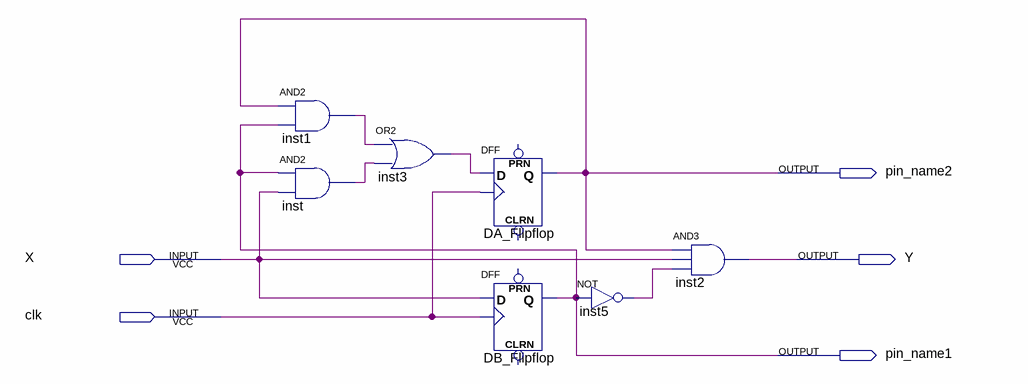
[diagram p0: schematic sheet]
// Quartus schematic Task0930.bdf as structural Verilog: 7 symbols, 5 pins
module Task0930 (
  input  X,
  input  clk,
  output pin_name2,
  output Y,
  output pin_name1
);

  wire inst1_out, inst3_out, inst5_out, inst_out;

  and inst1 (inst1_out, pin_name2, pin_name1);
  and inst (inst_out, pin_name1, X);
  or inst3 (inst3_out, inst1_out, inst_out);
  DFF DA_Flipflop (.CLK(clk), .D(inst3_out), .Q(pin_name2));  // open: CLRN, PRN
  DFF DB_Flipflop (.CLK(clk), .D(X), .Q(pin_name1));  // open: CLRN, PRN
  not inst5 (inst5_out, pin_name1);
  and inst2 (Y, pin_name2, X, inst5_out);
endmodule
